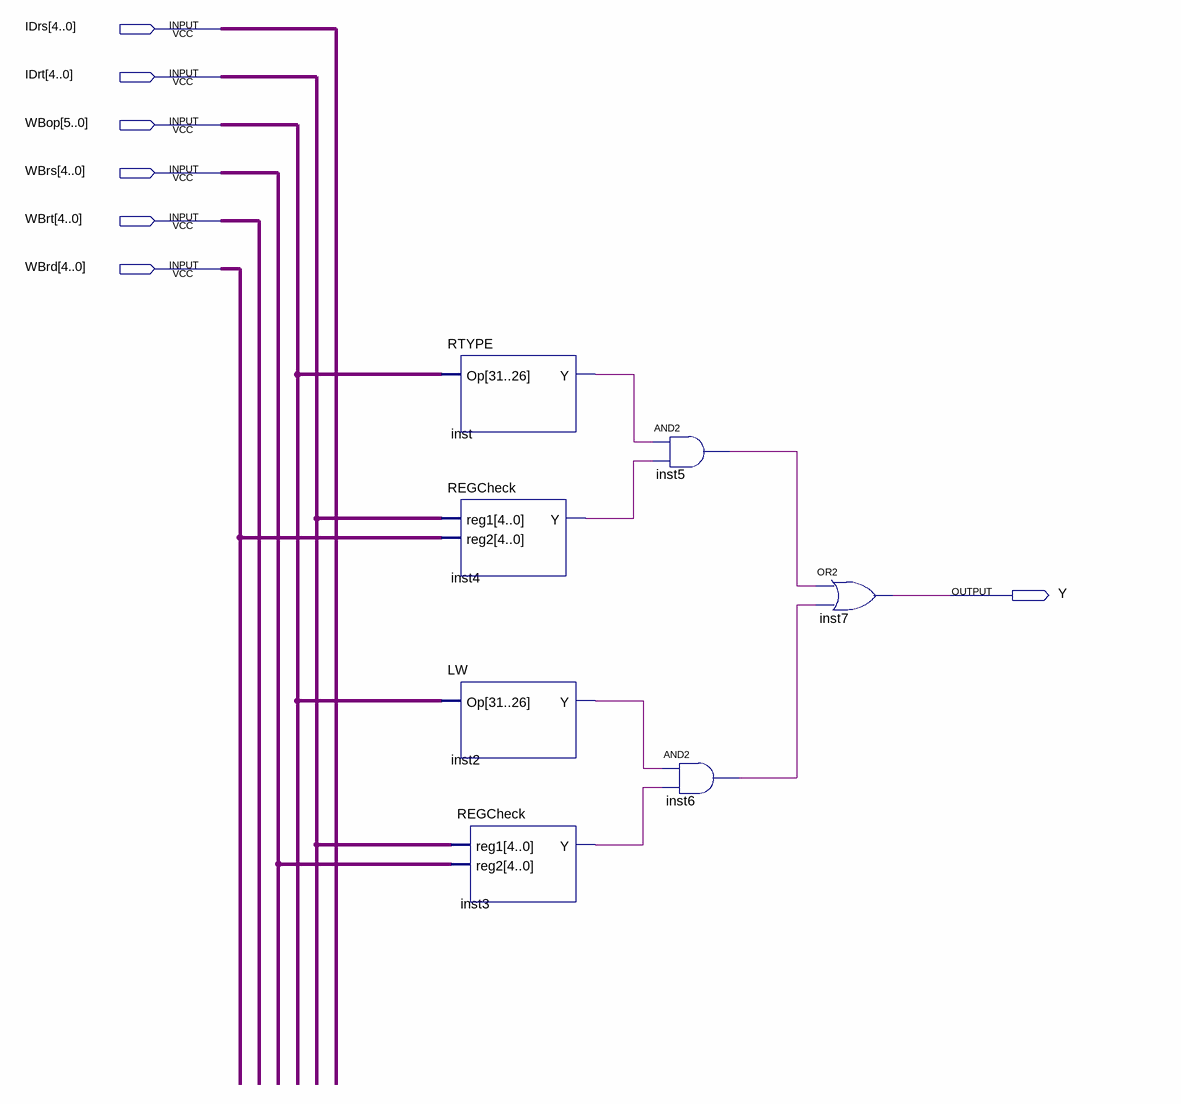
[diagram p0: schematic sheet]
// Quartus schematic ForwardBfromWBtoID.bdf as structural Verilog: 7 symbols, 7 pins
module ForwardBfromWBtoID (
  input  [4:0] IDrs,
  input  [4:0] IDrt,
  input  [5:0] WBop,
  input  [4:0] WBrs,
  input  [4:0] WBrt,
  input  [4:0] WBrd,
  output Y
);

  wire inst2_y, inst3_y, inst4_y, inst5_out, inst6_out, inst_y;

  RTYPE inst (.Op(WBop), .Y(inst_y));
  REGCheck inst4 (.reg1(IDrt), .reg2(WBrd), .Y(inst4_y));
  LW inst2 (.Op(WBop), .Y(inst2_y));
  REGCheck inst3 (.reg1(IDrt), .reg2(WBrs), .Y(inst3_y));
  and inst5 (inst5_out, inst_y, inst4_y);
  and inst6 (inst6_out, inst2_y, inst3_y);
  or inst7 (Y, inst5_out, inst6_out);
endmodule
